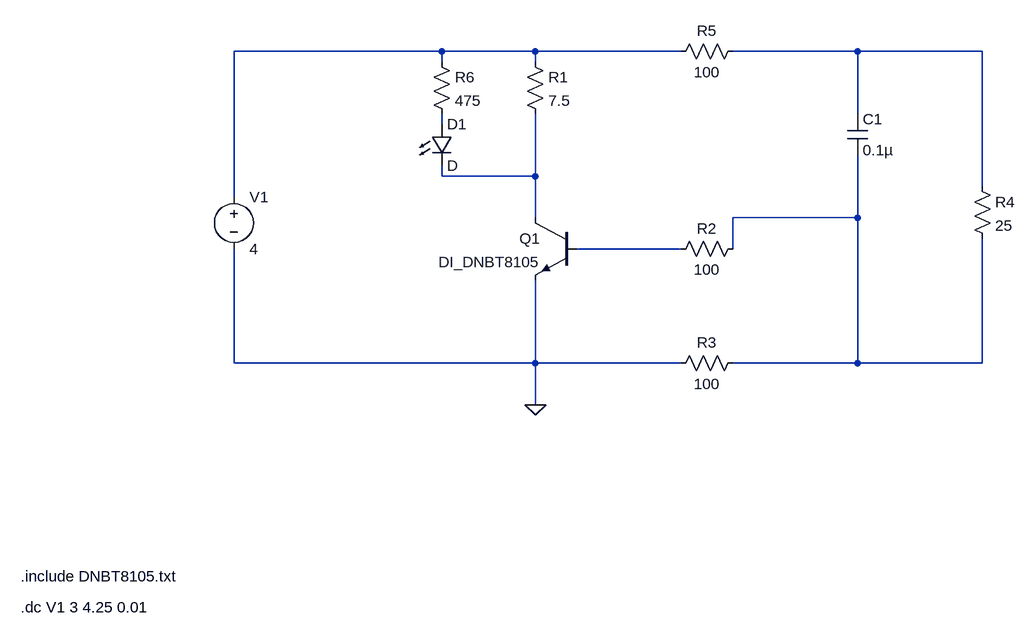
[diagram p0: schematic CellBalancingCircuit.asc]
CellBalancingCircuit.asc, the LTspice schematic file:
Version 4
SHEET 1 1288 680
WIRE 400 -496 80 -496
WIRE 544 -496 400 -496
WIRE 768 -496 544 -496
WIRE 1040 -496 848 -496
WIRE 1232 -496 1040 -496
WIRE 400 -480 400 -496
WIRE 544 -480 544 -496
WIRE 1040 -400 1040 -496
WIRE 400 -384 400 -400
WIRE 400 -304 400 -320
WIRE 544 -304 544 -400
WIRE 544 -304 400 -304
WIRE 1232 -288 1232 -496
WIRE 80 -272 80 -496
WIRE 544 -240 544 -304
WIRE 1040 -240 1040 -336
WIRE 1040 -240 848 -240
WIRE 768 -192 608 -192
WIRE 848 -192 848 -240
WIRE 80 -16 80 -192
WIRE 544 -16 544 -144
WIRE 544 -16 80 -16
WIRE 768 -16 544 -16
WIRE 1040 -16 1040 -240
WIRE 1040 -16 848 -16
WIRE 1232 -16 1232 -208
WIRE 1232 -16 1040 -16
WIRE 544 48 544 -16
FLAG 544 48 0
SYMBOL npn 608 -240 M0
SYMATTR InstName Q1
SYMATTR Value DI_DNBT8105
SYMBOL voltage 80 -288 R0
WINDOW 123 0 0 Left 0
WINDOW 39 0 0 Left 0
SYMATTR InstName V1
SYMATTR Value 4
SYMBOL res 528 -496 R0
SYMATTR InstName R1
SYMATTR Value 7.5
SYMBOL res 864 -32 R90
WINDOW 0 0 56 VBottom 2
WINDOW 3 32 56 VTop 2
SYMATTR InstName R3
SYMATTR Value 100
SYMBOL res 1216 -304 R0
SYMATTR InstName R4
SYMATTR Value 25
SYMBOL res 864 -512 R90
WINDOW 0 0 56 VBottom 2
WINDOW 3 32 56 VTop 2
SYMATTR InstName R5
SYMATTR Value 100
SYMBOL res 864 -208 R90
WINDOW 0 0 56 VBottom 2
WINDOW 3 32 56 VTop 2
SYMATTR InstName R2
SYMATTR Value 100
SYMBOL cap 1024 -400 R0
SYMATTR InstName C1
SYMATTR Value 0.1µ
SYMBOL LED 384 -384 R0
SYMATTR InstName D1
SYMBOL res 384 -496 R0
SYMATTR InstName R6
SYMATTR Value 475
TEXT -248 312 Left 2 !.include DNBT8105.txt
TEXT -248 360 Left 2 !.dc V1 3 4.25 0.01

The netlist it stands for:
* CellBalancingCircuit.asc
Q1 N004 N006 0 0 DI_DNBT8105
V1 N001 0 4
R1 N001 N004 7.5
R3 N005 0 100
R4 N002 N005 25
R5 N002 N001 100
R2 N005 N006 100
C1 N002 N005 0.1µ
D1 N003 N004 D
R6 N001 N003 475
.model D D
.lib standard.dio
.model NPN NPN
.model PNP PNP
.lib standard.bjt
.include DNBT8105.txt
.dc V1 3 4.25 0.01
.backanno
.end